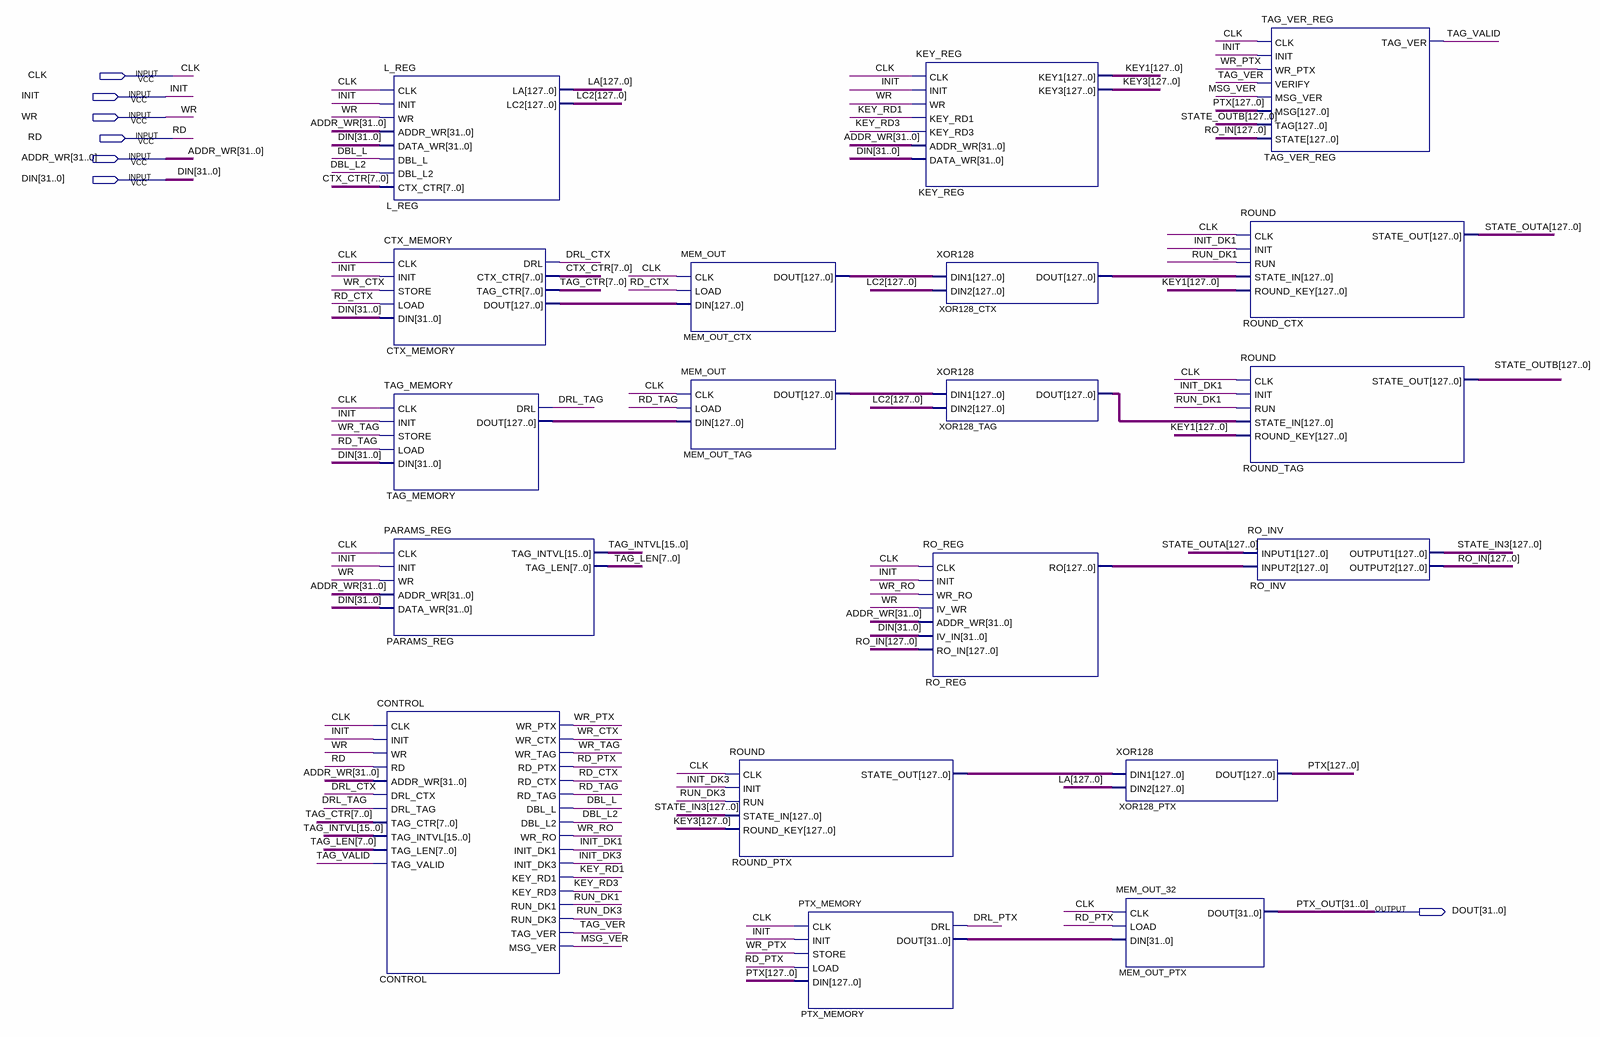
[diagram p0: schematic sheet]
// Quartus schematic COLM_D.bdf as structural Verilog: 19 symbols, 7 pins
module COLM_D (
  input  CLK,
  input  INIT,
  input  WR,
  input  RD,
  input  [31:0] ADDR_WR,
  input  [31:0] DIN,
  output [31:0] DOUT
);

  wire DBL_L, DBL_L2, DRL_CTX, DRL_PTX, DRL_TAG, INIT_DK1, INIT_DK3, KEY_RD1, KEY_RD3, MSG_VER, RD_CTX,
       RD_PTX, RD_TAG, RUN_DK1, RUN_DK3, TAG_VALID, TAG_VER, WR_CTX, WR_PTX, WR_RO, WR_TAG;
  wire [7:0] CTX_CTR, TAG_CTR, TAG_LEN;
  wire [15:0] TAG_INTVL;
  wire [31:0] PTX_MEMORY_dout;
  wire [127:0] CTX_MEMORY_dout, KEY1, KEY3, LA, LC2, MEM_OUT_CTX_dout, MEM_OUT_TAG_dout, PTX, RO_IN,
       RO_REG_ro, ROUND_PTX_state_out, STATE_IN3, STATE_OUTA, STATE_OUTB, TAG_MEMORY_dout, XOR128_CTX_dout,
       XOR128_TAG_dout;

  L_REG L_REG (
    .CLK(CLK), .INIT(INIT), .WR(WR), .ADDR_WR(ADDR_WR), .DATA_WR(DIN), .DBL_L(DBL_L), .DBL_L2(DBL_L2),
    .CTX_CTR(CTX_CTR), .LA(LA), .LC2(LC2));
  CTX_MEMORY CTX_MEMORY (
    .CLK(CLK), .INIT(INIT), .STORE(WR_CTX), .LOAD(RD_CTX), .DIN(DIN), .DRL(DRL_CTX), .CTX_CTR(CTX_CTR),
    .TAG_CTR(TAG_CTR), .DOUT(CTX_MEMORY_dout));
  TAG_MEMORY TAG_MEMORY (
    .CLK(CLK), .INIT(INIT), .STORE(WR_TAG), .LOAD(RD_TAG), .DIN(DIN), .DRL(DRL_TAG), .DOUT(TAG_MEMORY_dout));
  PARAMS_REG PARAMS_REG (
    .CLK(CLK), .INIT(INIT), .WR(WR), .ADDR_WR(ADDR_WR), .DATA_WR(DIN), .TAG_INTVL(TAG_INTVL),
    .TAG_LEN(TAG_LEN));
  CONTROL CONTROL (
    .CLK(CLK), .INIT(INIT), .WR(WR), .RD(RD), .ADDR_WR(ADDR_WR), .DRL_CTX(DRL_CTX), .DRL_TAG(DRL_TAG),
    .TAG_CTR(TAG_CTR), .TAG_INTVL(TAG_INTVL), .TAG_LEN(TAG_LEN), .TAG_VALID(TAG_VALID), .WR_PTX(WR_PTX),
    .WR_CTX(WR_CTX), .WR_TAG(WR_TAG), .RD_PTX(RD_PTX), .RD_CTX(RD_CTX), .RD_TAG(RD_TAG), .DBL_L(DBL_L),
    .DBL_L2(DBL_L2), .WR_RO(WR_RO), .INIT_DK1(INIT_DK1), .INIT_DK3(INIT_DK3), .KEY_RD1(KEY_RD1),
    .KEY_RD3(KEY_RD3), .RUN_DK1(RUN_DK1), .RUN_DK3(RUN_DK3), .TAG_VER(TAG_VER), .MSG_VER(MSG_VER));
  MEM_OUT MEM_OUT_CTX (.CLK(CLK), .LOAD(RD_CTX), .DIN(CTX_MEMORY_dout), .DOUT(MEM_OUT_CTX_dout));
  MEM_OUT MEM_OUT_TAG (.CLK(CLK), .LOAD(RD_TAG), .DIN(TAG_MEMORY_dout), .DOUT(MEM_OUT_TAG_dout));
  ROUND ROUND_PTX (
    .CLK(CLK), .INIT(INIT_DK3), .RUN(RUN_DK3), .STATE_IN(STATE_IN3), .ROUND_KEY(KEY3),
    .STATE_OUT(ROUND_PTX_state_out));
  PTX_MEMORY PTX_MEMORY (
    .CLK(CLK), .INIT(INIT), .STORE(WR_PTX), .LOAD(RD_PTX), .DIN(PTX), .DRL(DRL_PTX), .DOUT(PTX_MEMORY_dout));
  KEY_REG KEY_REG (
    .CLK(CLK), .INIT(INIT), .WR(WR), .KEY_RD1(KEY_RD1), .KEY_RD3(KEY_RD3), .ADDR_WR(ADDR_WR), .DATA_WR(DIN),
    .KEY1(KEY1), .KEY3(KEY3));
  XOR128 XOR128_CTX (.DIN1(MEM_OUT_CTX_dout), .DIN2(LC2), .DOUT(XOR128_CTX_dout));
  XOR128 XOR128_TAG (.DIN1(MEM_OUT_TAG_dout), .DIN2(LC2), .DOUT(XOR128_TAG_dout));
  RO_REG RO_REG (
    .CLK(CLK), .INIT(INIT), .WR_RO(WR_RO), .IV_WR(WR), .ADDR_WR(ADDR_WR), .IV_IN(DIN), .RO_IN(RO_IN),
    .RO(RO_REG_ro));
  XOR128 XOR128_PTX (.DIN1(ROUND_PTX_state_out), .DIN2(LA), .DOUT(PTX));
  MEM_OUT_32 MEM_OUT_PTX (.CLK(CLK), .LOAD(RD_PTX), .DIN(PTX_MEMORY_dout), .DOUT(DOUT));
  TAG_VER_REG TAG_VER_REG (
    .CLK(CLK), .INIT(INIT), .WR_PTX(WR_PTX), .VERIFY(TAG_VER), .MSG_VER(MSG_VER), .MSG(PTX),
    .TAG(STATE_OUTB), .STATE(RO_IN), .TAG_VER(TAG_VALID));
  ROUND ROUND_CTX (
    .CLK(CLK), .INIT(INIT_DK1), .RUN(RUN_DK1), .STATE_IN(XOR128_CTX_dout), .ROUND_KEY(KEY1),
    .STATE_OUT(STATE_OUTA));
  ROUND ROUND_TAG (
    .CLK(CLK), .INIT(INIT_DK1), .RUN(RUN_DK1), .STATE_IN(XOR128_TAG_dout), .ROUND_KEY(KEY1),
    .STATE_OUT(STATE_OUTB));
  RO_INV RO_INV (.INPUT1(STATE_OUTA), .INPUT2(RO_REG_ro), .OUTPUT1(STATE_IN3), .OUTPUT2(RO_IN));

  // Other names for the same wires on the sheet: PTX_OUT[31:0] = DOUT
endmodule
